# Altium schematic sheet ЦТЕА4.324.039_Э3_2.SchDoc
size 420 x 297 mm; ApprovedBy: Соколов; CheckedBy: Крушинская; DrawnBy: Бунтов; DocumentNumber: ЦТЕА4.324.039 Э3; SheetNumber: 2; SheetTotal: 3; Title1str: Плата управления; Title2str: и индикации телеметрии; ProcessInspection: Кудряшова; DocumentType1str: Схема электрическая; DocumentType2str: принципиальная; PageSetup: Record=PageOptionsZCenterHorizontal=TrueZCenterVertical=TrueZPrintScale=0.67ZXCorrection=1.00ZYCorrection=1.00ZPrintKind=1ZBorderSize=5000000ZLeftOffset=0ZBottomOffset=0ZOrientation=2ZPaperLength=1000ZPaperWidth=1000ZScale=100ZPaperSource=258ZPrintQuality=600ZMediaType=1ZDitherType=10ZPaperKind=A4ZPrintScaleMode=1; ImagePath: ЦТЕА4.324.039; Rule: PcbType=ProtelPcb
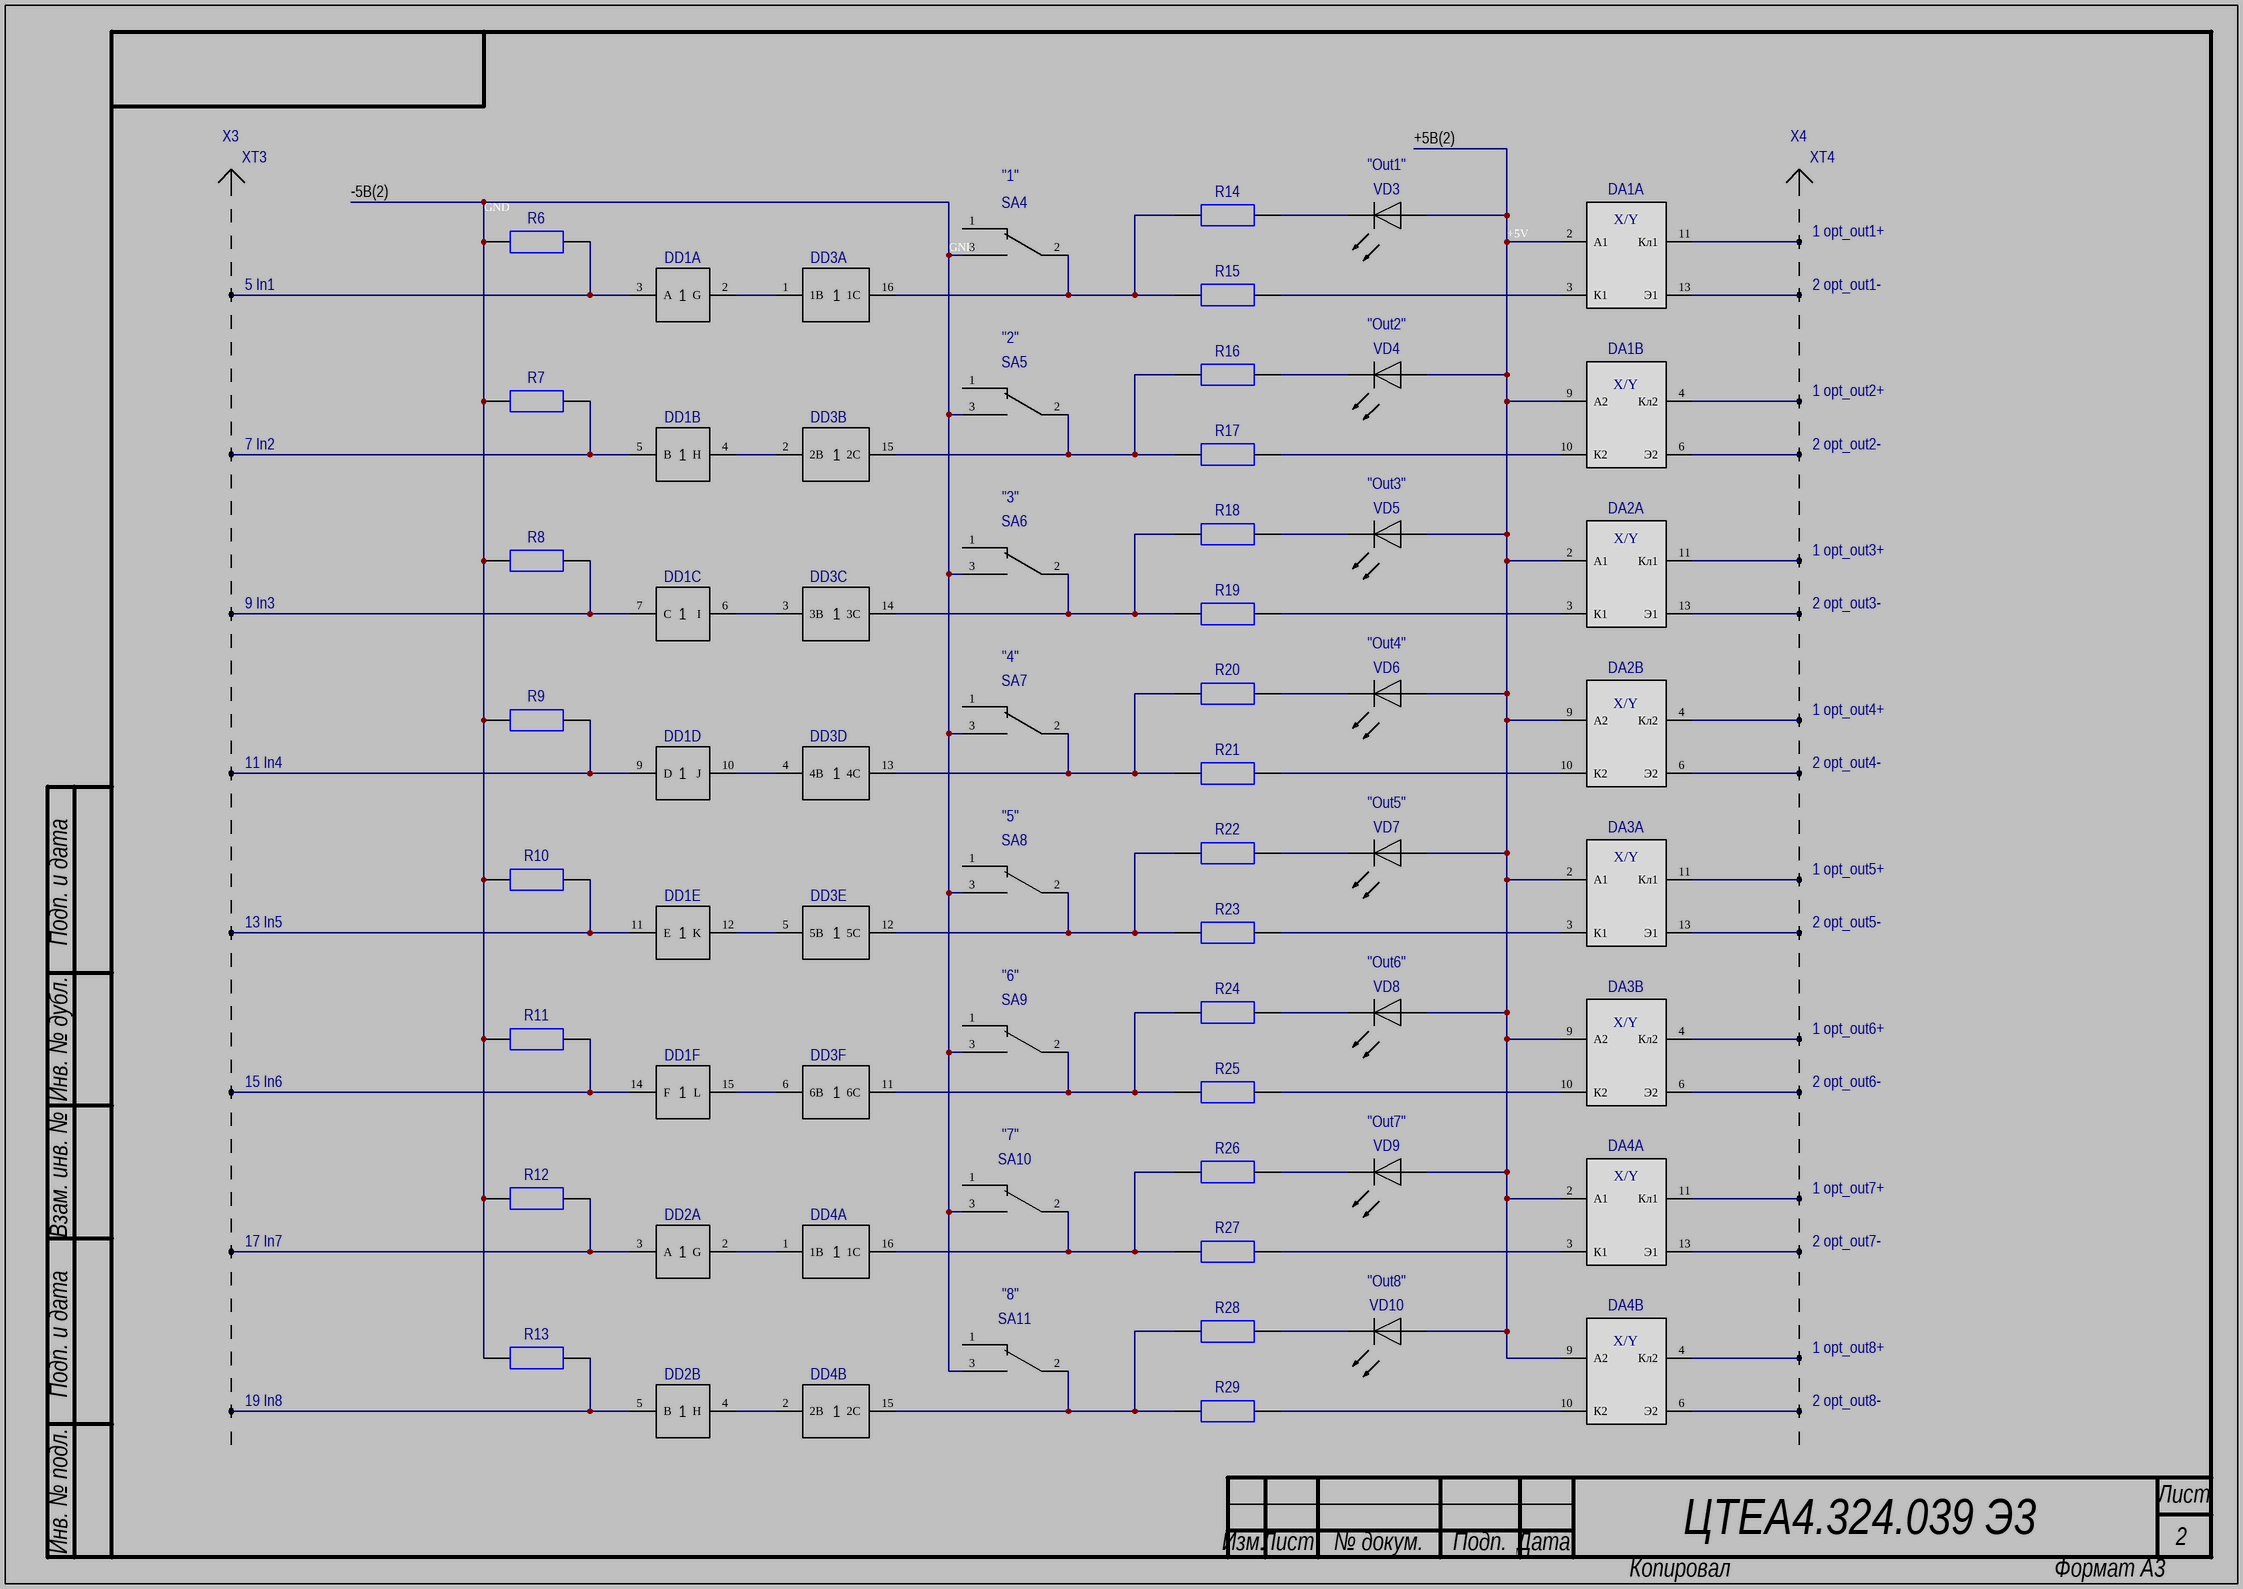
[diagram p0: ЦТЕА4.324.039_Э3_2.SchDoc]

## Parts
DA1  249КП1С  [249KP1S-44_3208_125_12]  (value not drawn)  (parts A,B of 2)
DA2  249КП1С  [249KP1S-44_3208_125_12]  (value not drawn)  (parts A,B of 2)
DA3  249КП1С  [249KP1S-44_3208_125_12]  (value not drawn)  (parts A,B of 2)
DA4  249КП1С  [249KP1S-44_3208_125_12]  (value not drawn)  (parts A,B of 2)
DD1  Mikroshema  [CD4050BD]  (value not drawn)  (parts A,B,C,D,E,F of 7)
DD2  Mikroshema  [CD4050BD]  (value not drawn)  (parts A,B of 7)
DD3  Mikroshema  [UL2004AD]  (value not drawn)  (parts A,B,C,D,E,F of 8)
DD4  Mikroshema  [UL2004AD]  (value not drawn)  (parts A,B of 8)
R6  Res  [CR1206-JW-3301ELF]  (value not drawn)
R7  Res  [CR1206-JW-3301ELF]  (value not drawn)
R8  Res  [CR1206-JW-3301ELF]  (value not drawn)
R9  Res  [CR1206-JW-3301ELF]  (value not drawn)
R10  Res  [CR1206-JW-3301ELF]  (value not drawn)
R11  Res  [CR1206-JW-3301ELF]  (value not drawn)
R12  Res  [CR1206-JW-3301ELF]  (value not drawn)
R13  Res  [CR1206-JW-3301ELF]  (value not drawn)
R14  Res  [CR1206-JW-4700ELF]  (value not drawn)
R15  Res  [CR1206-JW-3300ELF]  (value not drawn)
R16  Res  [CR1206-JW-4700ELF]  (value not drawn)
R17  Res  [CR1206-JW-3300ELF]  (value not drawn)
R18  Res  [CR1206-JW-4700ELF]  (value not drawn)
R19  Res  [CR1206-JW-3300ELF]  (value not drawn)
R20  Res  [CR1206-JW-4700ELF]  (value not drawn)
R21  Res  [CR1206-JW-3300ELF]  (value not drawn)
R22  Res  [CR1206-JW-4700ELF]  (value not drawn)
R23  Res  [CR1206-JW-3300ELF]  (value not drawn)
R24  Res  [CR1206-JW-4700ELF]  (value not drawn)
R25  Res  [CR1206-JW-3300ELF]  (value not drawn)
R26  Res  [CR1206-JW-4700ELF]  (value not drawn)
R27  Res  [CR1206-JW-3300ELF]  (value not drawn)
R28  Res  [CR1206-JW-4700ELF]  (value not drawn)
R29  Res  [CR1206-JW-3300ELF]  (value not drawn)
SA4  "1"  [7107SYZQE]
SA5  "2"  [7107SYZQE]
SA6  "3"  [7107SYZQE]
SA7  "4"  [7107SYZQE]
SA8  "5"  [7107SYZQE]
SA9  "6"  [7107SYZQE]
SA10  "7"  [7107SYZQE]
SA11  "8"  [7107SYZQE]
VD3  "Out1"  [HLMP-D150]
VD4  "Out2"  [HLMP-D150]
VD5  "Out3"  [HLMP-D150]
VD6  "Out4"  [HLMP-D150]
VD7  "Out5"  [HLMP-D150]
VD8  "Out6"  [HLMP-D150]
VD9  "Out7"  [HLMP-D150]
VD10  "Out8"  [HLMP-D150]
XT3  5 In1  [PLD-40]  (parts E,G,I,K,M,O,Q,S of 40)
XT4  1 opt_out1+  [PLD-18]  (parts A,B,C,D,E,F,G,H,I,J,K,L,M,N,O,P of 18)

## Nets
+5V: DA1.2(А1) DA1.9(А2) DA2.2(А1) DA2.9(А2) DA3.2(А1) DA3.9(А2) DA4.2(А1) DA4.9(А2) VD3.1(A) VD4.1(A) VD5.1(A) VD6.1(A) VD7.1(A) VD8.1(A) VD9.1(A) VD10.1(A)
GND: R6.1 R7.1 R8.1 R9.1 R10.1 R11.1 R12.1 R13.1 SA4.3 SA5.3 SA6.3 SA7.3 SA8.3 SA9.3 SA10.3 SA11.3
NetDA1_3: DA1.3(К1) R15.2
NetDA1_4: DA1.4(Кл2) XT4.3
NetDA1_6: DA1.6(Э2) XT4.4
NetDA1_10: DA1.10(К2) R17.2
NetDA1_11: DA1.11(Кл1) XT4.1
NetDA1_13: DA1.13(Э1) XT4.2
NetDA2_3: DA2.3(К1) R19.2
NetDA2_4: DA2.4(Кл2) XT4.7
NetDA2_6: DA2.6(Э2) XT4.8
NetDA2_10: DA2.10(К2) R21.2
NetDA2_11: DA2.11(Кл1) XT4.5
NetDA2_13: DA2.13(Э1) XT4.6
NetDA3_3: DA3.3(К1) R23.2
NetDA3_4: DA3.4(Кл2) XT4.11
NetDA3_6: DA3.6(Э2) XT4.12
NetDA3_10: DA3.10(К2) R25.2
NetDA3_11: DA3.11(Кл1) XT4.9
NetDA3_13: DA3.13(Э1) XT4.10
NetDA4_3: DA4.3(К1) R27.2
NetDA4_4: DA4.4(Кл2) XT4.15
NetDA4_6: DA4.6(Э2) XT4.16
NetDA4_10: DA4.10(К2) R29.2
NetDA4_11: DA4.11(Кл1) XT4.13
NetDA4_13: DA4.13(Э1) XT4.14
NetDD1_2: DD1.2(G) DD3.1(1B)
NetDD1_3: DD1.3(A) R6.2 XT3.5
NetDD1_4: DD1.4(H) DD3.2(2B)
NetDD1_5: DD1.5(B) R7.2 XT3.7
NetDD1_6: DD1.6(I) DD3.3(3B)
NetDD1_7: DD1.7(C) R8.2 XT3.9
NetDD1_9: DD1.9(D) R9.2 XT3.11
NetDD1_10: DD1.10(J) DD3.4(4B)
NetDD1_11: DD1.11(E) R10.2 XT3.13
NetDD1_12: DD1.12(K) DD3.5(5B)
NetDD1_14: DD1.14(F) R11.2 XT3.15
NetDD1_15: DD1.15(L) DD3.6(6B)
NetDD2_2: DD2.2(G) DD4.1(1B)
NetDD2_3: DD2.3(A) R12.2 XT3.17
NetDD2_4: DD2.4(H) DD4.2(2B)
NetDD2_5: DD2.5(B) R13.2 XT3.19
NetDD3_11: DD3.11(6C) R24.1 R25.1 SA9.2
NetDD3_12: DD3.12(5C) R22.1 R23.1 SA8.2
NetDD3_13: DD3.13(4C) R20.1 R21.1 SA7.2
NetDD3_14: DD3.14(3C) R18.1 R19.1 SA6.2
NetDD3_15: DD3.15(2C) R16.1 R17.1 SA5.2
NetDD3_16: DD3.16(1C) R14.1 R15.1 SA4.2
NetDD4_15: DD4.15(2C) R28.1 R29.1 SA11.2
NetDD4_16: DD4.16(1C) R26.1 R27.1 SA10.2
NetR14_2: R14.2 VD3.2(C)
NetR16_2: R16.2 VD4.2(C)
NetR18_2: R18.2 VD5.2(C)
NetR20_2: R20.2 VD6.2(C)
NetR22_2: R22.2 VD7.2(C)
NetR24_2: R24.2 VD8.2(C)
NetR26_2: R26.2 VD9.2(C)
NetR28_2: R28.2 VD10.2(C)

Not connected (* = marked no-connect by the designer): SA4 1; SA5 1; SA6 1; SA7 1; SA8 1; SA9 1; SA10 1; SA11 1

## Notes on the sheet
- X3
- XT3
- +5В(2)
- X4
- XT4
- -5В(2)
- Подп. и дата
- Инв. № дубл.
- Взам. инв. №
- Инв. № подл.
- Лист
- Изм.
- № докум.
- Подп.
- Дата
- Копировал
- Формат А3
- (in symbol Microshema, part A) Х/Y
- (in symbol Microshema, part B) Х/Y

## Library data of the parts
DA1-DA4 = Microshema
DD1 DD2 = Mikroshema: CD4050BD
DD3 DD4 = Mikroshema: ULN2004
R6-R29 = Rezistor
SA4-SA11 = Perekljuchatel
VD3-VD10 = Svetodiod
XT3 XT4 = Razem shtyrevoj: Наименование: *; Название: *